# Altium schematic sheet ZAtechSensor3 v1_01.SCHDOC
size A3
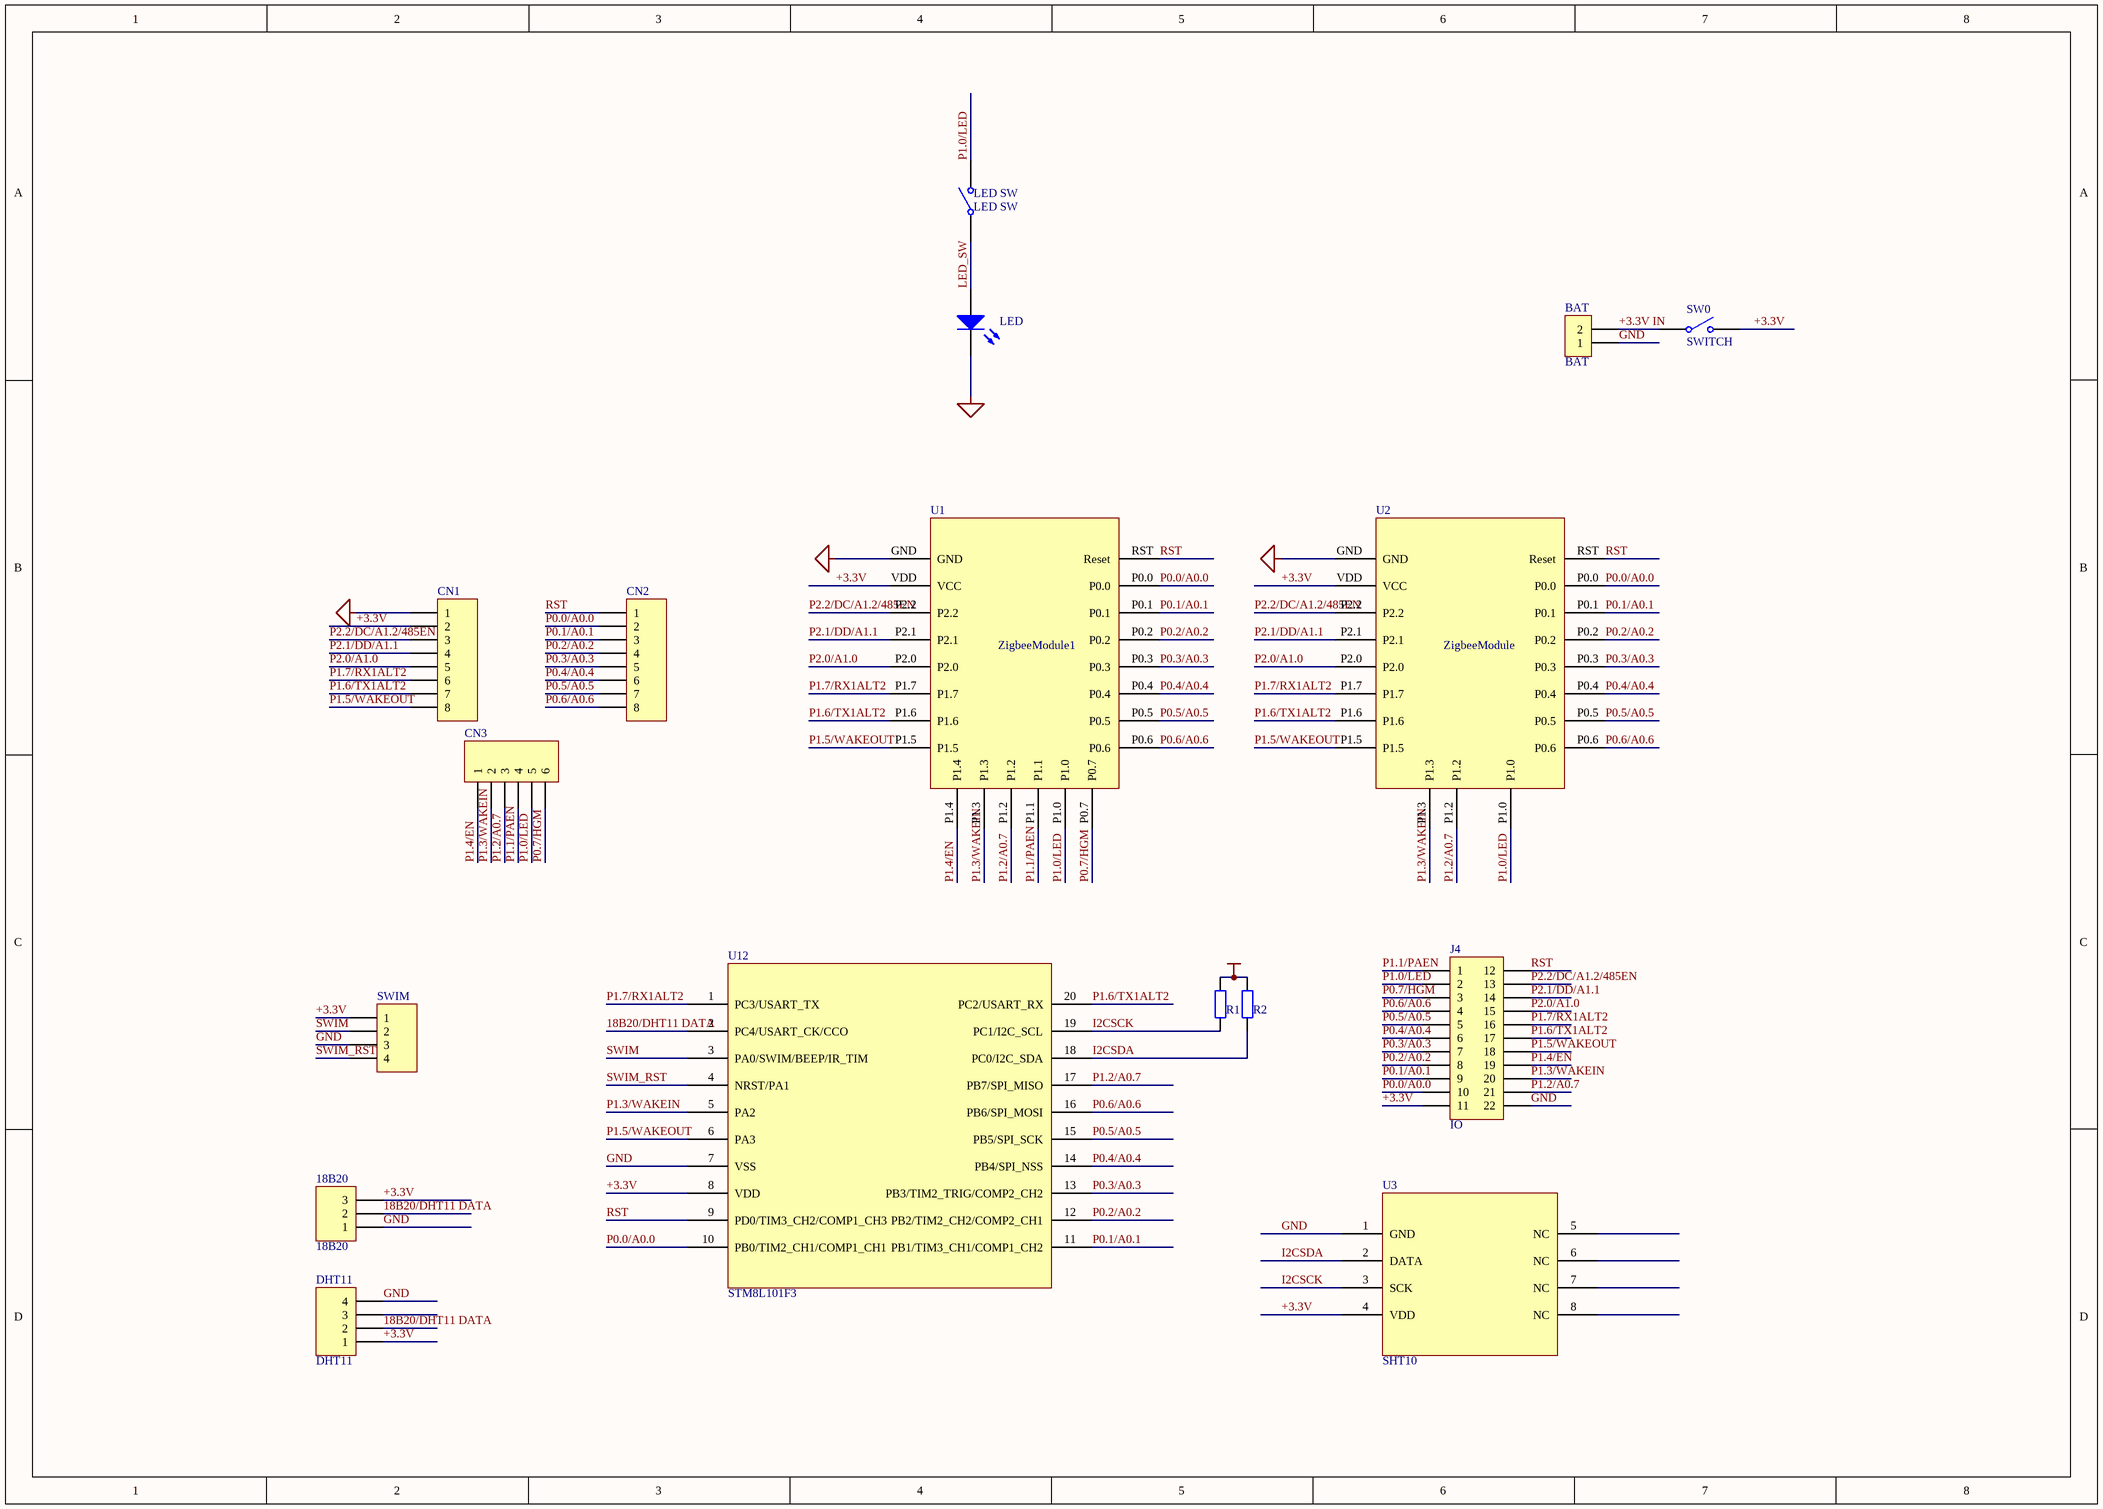
[diagram p0: ZAtechSensor3 v1_01.SCHDOC]

## Parts
18B20  18B20  [BCY-W3]
BAT  BAT  [HDR1X2]
CN1  (no value)  [HDR1X8]
CN2  (no value)  [HDR1X8]
CN3  (no value)  [HDR1X6]
DHT11  DHT11  [HDR1X4]
J4  IO  [HDR2X11_CEN]
LED  LED3  [LED1-3MM]  (value not drawn)
LED_SW  LED SW  [HDR1X2]
R1  4.7K  [0402]  (value not drawn)
R2  4.7K  [0402]  (value not drawn)
SW0  SWITCH  [SW5]
SWIM  RST  GND  DATA  VDD  [HDR1X4]  (value not drawn)
U1  ZigbeeModule1  [2530Module1]
U2  ZigbeeModule  [2591Module]
U3  SHT10
U12  STM8L101F3  [TSSOP20]

## Nets
+3.3V: 18B20.3 CN1.2 DHT11.1 J4.11 R1.1 R2.1 SW0.2 SWIM.1 U1.VDD(VCC) U2.VDD(VCC) U3.4(VDD) U12.8(VDD)
GND: 18B20.1 BAT.1 CN1.1 DHT11.4 J4.22 LED.2(K) SWIM.3 U1.GND U2.GND U3.1(GND) U12.7(VSS)
18B20/DHT11 DATA: 18B20.2 DHT11.2 U12.2(PC4/USART_CK/CCO)
+3.3V IN: BAT.2 SW0.1
I2CSCK: R1.2 U3.3(SCK) U12.19(PC1/I2C_SCL)
I2CSDA: R2.2 U3.2(DATA) U12.18(PC0/I2C_SDA)
LED_SW: LED.1(A) LED_SW.1(COMMON)
P0.0/A0.0: CN2.2 J4.10 U1.P0.0 U2.P0.0 U12.10(PB0/TIM2_CH1/COMP1_CH1)
P0.1/A0.1: CN2.3 J4.9 U1.P0.1 U2.P0.1 U12.11(PB1/TIM3_CH1/COMP1_CH2)
P0.2/A0.2: CN2.4 J4.8 U1.P0.2 U2.P0.2 U12.12(PB2/TIM2_CH2/COMP2_CH1)
P0.3/A0.3: CN2.5 J4.7 U1.P0.3 U2.P0.3 U12.13(PB3/TIM2_TRIG/COMP2_CH2)
P0.4/A0.4: CN2.6 J4.6 U1.P0.4 U2.P0.4 U12.14(PB4/SPI_NSS)
P0.5/A0.5: CN2.7 J4.5 U1.P0.5 U2.P0.5 U12.15(PB5/SPI_SCK)
P0.6/A0.6: CN2.8 J4.4 U1.P0.6 U2.P0.6 U12.16(PB6/SPI_MOSI)
P0.7/HGM: CN3.6 J4.3 U1.P0.7
P1.0/LED: CN3.5 J4.2 LED_SW.2(NO) U1.P1.0 U2.P1.0
P1.1/PAEN: CN3.4 J4.1 U1.P1.1
P1.2/A0.7: CN3.3 J4.21 U1.P1.2 U2.P1.2 U12.17(PB7/SPI_MISO)
P1.3/WAKEIN: CN3.2 J4.20 U1.P1.3 U2.P1.3 U12.5(PA2)
P1.4/EN: CN3.1 J4.19 U1.P1.4
P1.5/WAKEOUT: CN1.8 J4.18 U1.P1.5 U2.P1.5 U12.6(PA3)
P1.6/TX1ALT2: CN1.7 J4.17 U1.P1.6 U2.P1.6 U12.20(PC2/USART_RX)
P1.7/RX1ALT2: CN1.6 J4.16 U1.P1.7 U2.P1.7 U12.1(PC3/USART_TX)
P2.0/A1.0: CN1.5 J4.15 U1.P2.0 U2.P2.0
P2.1/DD/A1.1: CN1.4 J4.14 U1.P2.1 U2.P2.1
P2.2/DC/A1.2/485EN: CN1.3 J4.13 U1.P2.2 U2.P2.2
RST: CN2.1 J4.12 U1.RST(Reset) U2.RST(Reset) U12.9(PD0/TIM3_CH2/COMP1_CH3)
SWIM: SWIM.2 U12.3(PA0/SWIM/BEEP/IR_TIM)
SWIM_RST: SWIM.4 U12.4(NRST/PA1)

Not connected (* = marked no-connect by the designer): DHT11 3; U3 5(NC) 6(NC) 7(NC) 8(NC)

## Library data of the parts
18B20 = Header 3: Header, 3-Pin; Revision: 17-Jul-2002: Re-released for DXP Platform.; Publisher: Altium Limited
BAT = CON2
CN1 CN2 = Header 8: Header, 8-Pin; Revision: 17-Jul-2002: Re-released for DXP Platform.; Publisher: Altium Limited
CN3 = Header 6: Header, 6-Pin; Revision: 17-Jul-2002: Re-released for DXP Platform.; Publisher: Altium Limited
DHT11 SWIM = Header 4: Header, 4-Pin; Revision: 17-Jul-2002: Re-released for DXP Platform.; Publisher: Altium Limited
J4 = Header 11X2A: Header, 11-Pin, Dual row; Revision: 17-Jul-2002: Re-released for DXP Platform.; Publisher: Altium Limited
LED = LED3: Typical BLUE SiC LED; Revision 1: Jul-2002: Re-released for DXP Platform.; Revision 2: 17-Dec-2003: PCB Footprint replaced.; Published: 8-Jun-2000; Publisher: Altium Limited
LED_SW = SW-SPST: Single-Pole, Single-Throw Switch; Published: 24-Mar-1999; Revision: July-2002: Re-released for DXP Platform.; Publisher: Altium Limited
R1 R2 = Res2: Resistor; Revision: July-2002: Re-released for DXP Platform.
SW0 = SW-SPST: Single-Pole, Single-Throw Switch; pin to pad: 2>3; Published: 24-Mar-1999; Revision: July-2002: Re-released for DXP Platform.; Publisher: Altium Limited
U1 U2 = Component_1